# Altium schematic sheet [9] USB 2.0 .SchDoc: ARS Camera REV01 USB and WiFi
size A4; DrawnBy: Manh Ngo Van; Engineer: Manh Ngo Van; Organization: Altium Limited; Address1: L3, 12a Rodborough Rd; Address2: Frenchs Forest; Address3: NSW; Address4: Australia 2086; DocumentNumber: 9; Revision: 1.0; SheetNumber: 9; SheetTotal: 16
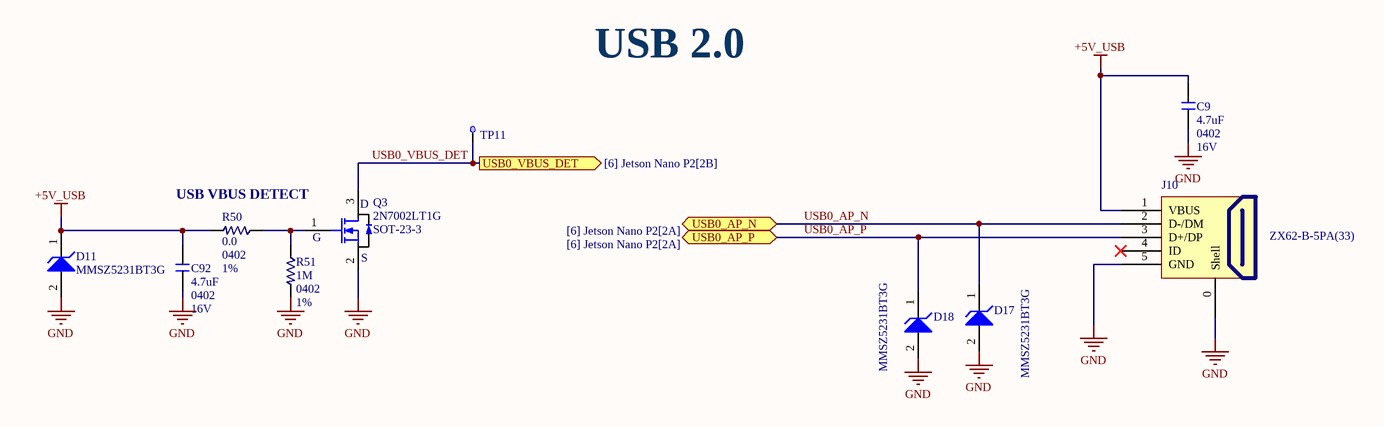
[diagram p0: [9] USB 2.0 .SchDoc]

## Parts
C9  4.7uF  Case/Package: 0402  Voltage Rating: 16V  [C0402M]
C92  4.7uF  Case/Package: 0402  Voltage Rating: 16V  [C0402M]
D11  MMSZ5231BT3G  [SODFL371X135-2N]
D17  MMSZ5231BT3G  [SODFL371X135-2N]
D18  MMSZ5231BT3G  [SODFL371X135-2N]
J10  ZX62-B-5PA(33)  [MICRO-USB-SMD_5P-P0.65-H-M_MICRO-USB-5P]
Q3  2N7002LT1G  Case/Package: SOT-23-3  [SOT95P245X110-3N]
R50  0.0  Case Code (Imperial): 0402  Tolerance: 1%  [R0402M]
R51  1M  Case Code (Imperial): 0402  Tolerance: 1%  [R0402M]
TP11  TP  [Test point]  (value not drawn)  (net tie, no BOM)

## Ports
USB0_AP_N (bidir, see [6] Jetson Nano P2[2A]), USB0_AP_P (bidir, see [6] Jetson Nano P2[2A]), USB0_VBUS_DET (out, see [6] Jetson Nano P2[2B])

## Nets
+5V_USB: C9.1 C92.1 D11.1(K) J10.1(VBUS) R50.1
GND: C9.2 C92.2 D11.2(A) D17.2(A) D18.2(A) J10.0(Shell) J10.5(GND) Q3.2(S) R51.1
USB0_AP_N: D17.1(K) J10.2(D-/DM) ; port USB0_AP_N
USB0_AP_P: D18.1(K) J10.3(D+/DP) ; port USB0_AP_P
USB0_VBUS_DET: Q3.3(D) TP11.1(TP) ; port USB0_VBUS_DET
NetQ3_1: Q3.1(G) R50.2 R51.2

Not connected (* = marked no-connect by the designer): J10 4(ID)*

## Notes on the sheet
- USB 2.0
- (near R50) USB VBUS DETECT
- Title
- Size:
- Date:
- A4
- Number:
- Time:
- Revision:
- Sheet
- of
- File:

## Library data of the parts
C9 C92 = CAP_CER: CAP CER 4.7UF 16V X5R 0402; Manufacturer: Samsung; Manufacturer Part Number: CL05A475MO5NUNC; Tolerance: 20%; ComponentLink1URL: https://datasheet.ciiva.com/25786/cl05a475mp5nrnc-25786963.pdf?src-supplier=Digi-Key; ComponentLink1Description: https://datasheet.ciiva.com/25786/cl05a475mp5nrnc-25786963.pdf?src-supplier=Digi-Key; ComponentLink2URL: https://datasheet.ciiva.com/16437/cl05b104kq5nnnc-16437353.pdf?src-supplier=Future+Electronics; ComponentLink2Description: https://datasheet.ciiva.com/16437/cl05b104kq5nnnc-16437353.pdf?src-supplier=Future+Electronics; Supplier 1: Digi-Key; Supplier Part Number 1: 1276-6836-6-ND; Stock 1: 1677309; Pricing 1: 1 = 0.45000, 10 = 0.32100, 100 = 0.21130, 500 = 0.15656, 1000 = 0.13307, 2500 = 0.12524, 5000 = 0.11741 (USD); RoHS: Yes; Mount: Surface Mount; Case Code (Imperial): 0402; Case Code (Metric): 1005; Min Operating Temperature: -55°C; Max Operating Temperature: 85°C; Packaging: Tape and Reel; Capacitance: 4.7uF; Length: 0.039inch; Width: 0.02inch; Thickness: 0.022inch; ComponentLink3URL: http://www.farnell.com/datasheets/2710653.pdf?src-supplier=Farnell; ComponentLink3Description: http://www.farnell.com/datasheets/2710653.pdf?src-supplier=Farnell; ComponentLink4URL: http://www.farnell.com/datasheets/2710653.pdf?src-supplier=Newark; ComponentLink4Description: http://www.farnell.com/datasheets/2710653.pdf?src-supplier=Newark; ComponentLink5URL: http://www.samsungsem.com/kr/support/product-search/mlcc/CL05A475MO5NUNC.jsp?src-supplier=Digi-Key; ComponentLink5Description: http://www.samsungsem.com/kr/support/product-search/mlcc/CL05A475MO5NUNC.jsp?src-supplier=Digi-Key
D11 D17 D18 = MMSZ5231BT3G: DIODE ZENER 5.1V 500MW SOD123; Manufacturer: ON Semiconductor; Impedance: 17R; Tolerance: 5%; ComponentLink1Description: Manufacturer URL; ComponentLink2Description: Datasheet; ComponentLink3Description: Package Specification; ComponentLink3URL: http://www.onsemi.com/pub_link/Collateral/425-04.PDF; ComponentLink1URL: http://www.onsemi.com/; ComponentLink2URL: http://www.onsemi.com/pub_link/Collateral/MMSZ5221BT1-D.PDF; ComponentLink4URL: https://media.digikey.com/pdf/Data%20Sheets/Ethertronics/M830120.pdf?src-supplier=Digi-Key; ComponentLink4Description: https://media.digikey.com/pdf/Data%20Sheets/Ethertronics/M830120.pdf?src-supplier=Digi-Key; ComponentLink5URL: http://datasheets.avx.com/ethertronics/AVX-E_M830120.pdf?src-supplier=Digi-Key; ComponentLink5Description: http://datasheets.avx.com/ethertronics/AVX-E_M830120.pdf?src-supplier=Digi-Key; Supplier 1: Digi-Key; Supplier Part Number 1: MMSZ5231BT3GOSCT-ND; Manufacturer Part Number: MMSZ5231BT3G; Stock 1: 3780; Pricing 1: 1 = 0.21000, 10 = 0.15000, 100 = 0.08090, 500 = 0.06350, 1000 = 0.04410, 2000 = 0.03653, 5000 = 0.03455 (USD); RoHS: Yes; Case/Package: SOD-123-2; Number of Pins: 2; Min Operating Temperature: -55°C; Max Operating Temperature: 150°C; Packaging: Tape and Reel; Zener Voltage: 5.1V; Max Power Dissipation: 500mW; Lead Free: Lead Free; ComponentLink6URL: http://www.mouser.com/ds/2/308/MMSZ5221BT1-D-85810.pdf?src-supplier=Mouser; ComponentLink6Description: http://www.mouser.com/ds/2/308/MMSZ5221BT1-D-85810.pdf?src-supplier=Mouser; ComponentLink7URL: https://4donline.ihs.com/images/VipMasterIC/IC/ONSM/ONSM-S-A0000726829/ONSM-S-A0000726829-1.pdf?hkey=52A5661711E402568146F3353EA87419&src-supplier=Farnell; ComponentLink7Description: https://4donline.ihs.com/images/VipMasterIC/IC/ONSM/ONSM-S-A0000726829/ONSM-S-A0000726829-1.pdf?hkey=52A5661711E402568146F3353EA87419&src-supplier=Farnell; ComponentLink8URL: http://www.onsemi.com/pub/Collateral/MMSZ5221BT1-D.PDF?src-supplier=Digi-Key; ComponentLink8Description: http://www.onsemi.com/pub/Collateral/MMSZ5221BT1-D.PDF?src-supplier=Digi-Key; ComponentLink9URL: https://4donline.ihs.com/images/VipMasterIC/IC/ONSM/ONSM-S-A0000726829/ONSM-S-A0000726829-1.pdf?hkey=52A5661711E402568146F3353EA87419&src-supplier=Newark; ComponentLink9Description: https://4donline.ihs.com/images/VipMasterIC/IC/ONSM/ONSM-S-A0000726829/ONSM-S-A0000726829-1.pdf?hkey=52A5661711E402568146F3353EA87419&src-supplier=Newark; ComponentLink10URL: http://www.onsemi.com/pub/Collateral/MMSZ5221BT1-D.PDF?src-supplier=Avnet; ComponentLink10Description: http://www.onsemi.com/pub/Collateral/MMSZ5221BT1-D.PDF?src-supplier=Avnet; ComponentLink11URL: http://www.onsemi.com/pub_link/Collateral/MMSZ5221BT1-D.PDF?src-supplier=Digi-Key; ComponentLink11Description: http://www.onsemi.com/pub_link/Collateral/MMSZ5221BT1-D.PDF?src-supplier=Digi-Key
J10 = USB Mini: USB - micro B USB 2.0 Receptacle Connector 5 Position Surface Mount, Right Angle; Manufacturer: Hirose; Number of Contacts: 5; USB Standard: USB 2.0; Current Rating: 1.8A; Mating Cycles: 10000; ComponentLink1URL: https://www.molex.com/pdm_docs/sd/1050170001_sd.pdf; ComponentLink1Description: https://www.molex.com/pdm_docs/sd/1050170001_sd.pdf; Supplier 1: Digi-Key; Supplier Part Number 1: H125270CT-ND; Manufacturer Part Number: ZX62-B-5PA(33); Stock 1: 8359; Pricing 1: 1 = 0.84000, 10 = 0.79200, 25 = 0.71280, 50 = 0.63360, 100 = 0.60720, 250 = 0.55440, 500 = 0.52800, 1000 = 0.43560 (USD); RoHS: Yes; Mount: Surface Mount,Horizontal; Contact Material: Copper Alloy; Contact Plating: Gold; Packaging: Tape and Reel; Connector Type: USB; Gender: Receptacle; Orientation: Right Angle; REACH SVHC: Unknown; Lead Free: Lead Free; ComponentLink2URL: http://www.farnell.com/datasheets/2691174.pdf?src-supplier=Farnell; ComponentLink2Description: http://www.farnell.com/datasheets/2691174.pdf?src-supplier=Farnell; ComponentLink3URL: http://www.farnell.com/datasheets/2691174.pdf?src-supplier=Element14; ComponentLink3Description: http://www.farnell.com/datasheets/2691174.pdf?src-supplier=Element14; ComponentLink4URL: https://www.hirose.com/product/en/download_file/key_name/ZX62-B-5PA%2833%29/category/Specification%20Sheet/doc_file_id/87473/?file_category_id=9&item_id=02420033833&is_series=&src-supplier=Digi-Key; ComponentLink4Description: https://www.hirose.com/product/en/download_file/key_name/ZX62-B-5PA%2833%29/category/Specification%20Sheet/doc_file_id/87473/?file_category_id=9&item_id=02420033833&is_series=&src-supplier=Digi-Key; ComponentLink5URL: http://www.farnell.com/datasheets/2060515.pdf?src-supplier=Element14; ComponentLink5Description: http://www.farnell.com/datasheets/2060515.pdf?src-supplier=Element14; ComponentLink6URL: http://www.farnell.com/datasheets/2691174.pdf?src-supplier=Newark; ComponentLink6Description: http://www.farnell.com/datasheets/2691174.pdf?src-supplier=Newark
Q3 = NMOS: MOSFET N-CH 60V 0.115A SOT-23; Manufacturer: ON Semiconductor; Gate to Source Voltage (Vgs): 20V; Continuous Drain Current (ID): 115mA; Turn-Off Delay Time: 40ns; Turn-On Delay Time: 20ns; Rds On Max: 7.5R; Input Capacitance: 50pF; Nominal Vgs: 2.5V; Number of Elements: 1; Max Power Dissipation: 225mW; Element Configuration: Single; Power Dissipation: 300mW; ComponentLink1URL: https://datasheet.ciiva.com/6371/dmn65d8l-6371124.pdf?src-supplier=Digi-Key; ComponentLink1Description: https://datasheet.ciiva.com/6371/dmn65d8l-6371124.pdf?src-supplier=Digi-Key; ComponentLink2URL: https://datasheet.ciiva.com/13058/dmn65d8l-219098-13058455.pdf?src-supplier=Mouser; ComponentLink2Description: https://datasheet.ciiva.com/13058/dmn65d8l-219098-13058455.pdf?src-supplier=Mouser; ComponentLink3URL: https://datasheet.ciiva.com/6371/dmn65d8l-6371126.pdf?src-supplier=Digi-Key; ComponentLink3Description: https://datasheet.ciiva.com/6371/dmn65d8l-6371126.pdf?src-supplier=Digi-Key; ComponentLink4URL: https://datasheet.ciiva.com/6371/dmn65d8l-6371128.pdf?src-supplier=Digi-Key; ComponentLink4Description: https://datasheet.ciiva.com/6371/dmn65d8l-6371128.pdf?src-supplier=Digi-Key; Supplier 1: Digi-Key; Supplier Part Number 1: 2N7002LT1GOSCT-ND; Manufacturer Part Number: 2N7002LT1G; Stock 1: 616639; Pricing 1: 1 = 0.18000, 10 = 0.16400, 25 = 0.15640, 100 = 0.06880, 250 = 0.06600, 500 = 0.05400, 1000 = 0.03750 (USD); RoHS: Yes; Number of Pins: 3; Contact Plating: Tin,Matte; Min Operating Temperature: -55°C; Max Operating Temperature: 150°C; Package Quantity: 1; On-State Resistance: 7.5R; Packaging: Tape and Reel; Drain to Source Voltage (Vdss): 60V; Drain to Source Breakdown Voltage: 60V; Drain to Source Resistance: 7.5R; Threshold Voltage: 2.5V; Voltage Rating (DC): 60V; Current Rating: 115mA; Number of Channels: 1; Length: 3.04mm; Height: 1.01mm; Width: 1.4mm; Radiation Hardening: No; Lead Free: Lead Free; Halogen Free: Halogen Free; REACH SVHC: No SVHC; ComponentLink5URL: https://datasheet.ciiva.com/936/2n7002l-d-936784.pdf?src-supplier=Digi-Key; ComponentLink5Description: https://datasheet.ciiva.com/936/2n7002l-d-936784.pdf?src-supplier=Digi-Key; ComponentLink6URL: https://datasheet.ciiva.com/22749/1747988-22749570.pdf?src-supplier=Element14; ComponentLink6Description: https://datasheet.ciiva.com/22749/1747988-22749570.pdf?src-supplier=Element14; ComponentLink7URL: https://datasheet.ciiva.com/1188/97418-1188470.pdf?src-supplier=Element14; ComponentLink7Description: https://datasheet.ciiva.com/1188/97418-1188470.pdf?src-supplier=Element14; ComponentLink8URL: https://datasheet.ciiva.com/936/2n7002l-d-936785.pdf?src-supplier=Digi-Key; ComponentLink8Description: https://datasheet.ciiva.com/936/2n7002l-d-936785.pdf?src-supplier=Digi-Key; ComponentLink9URL: https://datasheet.ciiva.com/936/2n7002l-d-936786.pdf?src-supplier=Digi-Key; ComponentLink9Description: https://datasheet.ciiva.com/936/2n7002l-d-936786.pdf?src-supplier=Digi-Key; ComponentLink10URL: https://datasheet.ciiva.com/1254/1747988-1254500.pdf?src-supplier=Newark; ComponentLink10Description: https://datasheet.ciiva.com/1254/1747988-1254500.pdf?src-supplier=Newark; ComponentLink11URL: https://datasheet.ciiva.com/24157/2n7002l-d-24157398.pdf?src-supplier=Future+Electronics; ComponentLink11Description: https://datasheet.ciiva.com/24157/2n7002l-d-24157398.pdf?src-supplier=Future+Electronics; ComponentLink12URL: https://datasheet.ciiva.com/1188/97418-1188471.pdf?src-supplier=Element14; ComponentLink12Description: https://datasheet.ciiva.com/1188/97418-1188471.pdf?src-supplier=Element14; ComponentLink13URL: https://datasheet.ciiva.com/8114/2n7002l-d-8114823.pdf?src-supplier=Avnet; ComponentLink13Description: https://datasheet.ciiva.com/8114/2n7002l-d-8114823.pdf?src-supplier=Avnet; ComponentLink14URL: https://datasheet.ciiva.com/3304/2n7002l-d-3304393.pdf?src-supplier=Avnet; ComponentLink14Description: https://datasheet.ciiva.com/3304/2n7002l-d-3304393.pdf?src-supplier=Avnet; ComponentLink15URL: https://datasheet.ciiva.com/26146/2n7002l-d-26146173.pdf?src-supplier=Avnet+Europe; ComponentLink15Description: https://datasheet.ciiva.com/26146/2n7002l-d-26146173.pdf?src-supplier=Avnet+Europe; ComponentLink16URL: https://datasheet.ciiva.com/16542/2n7002l-d-16542607.pdf?src-supplier=Avnet+Asia; ComponentLink16Description: https://datasheet.ciiva.com/16542/2n7002l-d-16542607.pdf?src-supplier=Avnet+Asia
R50 = RES_SMD: RES SMD 0 OHM JUMPER 1/16W 0402; Manufacturer: Yageo; Manufacturer Part Number: RC0402FR-070RL; Resistance: 0mR; Power Rating: 62.5mW; Voltage Rating: 50V; Temperature Coefficient: 200ppm/°C; Supplier 1: Digi-Key; Supplier Part Number 1: 311-0.0LRCT-ND; Stock 1: 3964331; Pricing 1: 1 = 0.10000, 10 = 0.01200, 25 = 0.00840, 50 = 0.00640, 100 = 0.00470, 250 = 0.00360, 500 = 0.00288, 1000 = 0.00212, 5000 = 0.00152 (USD); RoHS: Yes; Mount: Surface Mount; Case/Package: 0402; Contact Plating: Tin,Matte; Case Code (Metric): 1005; Min Operating Temperature: -55°C; Max Operating Temperature: 155°C; Resistor Type: Thick Film; Packaging: Tape and Reel; Termination: SMD/SMT; Length: 1mm; Width: 0.5mm; Height: 0.35mm; Radiation Hardening: No; Lead Free: Lead Free; ComponentLink1URL: https://datasheet.ciiva.com/8896/pyu-rc0402-51-rohs-l-6-8896149.pdf?src-supplier=Avnet; ComponentLink1Description: https://datasheet.ciiva.com/8896/pyu-rc0402-51-rohs-l-6-8896149.pdf?src-supplier=Avnet; ComponentLink2URL: https://datasheet.ciiva.com/16790/pyu-rc0402-51-rohs-l-6-r-16790444.pdf?src-supplier=Future+Electronics; ComponentLink2Description: https://datasheet.ciiva.com/16790/pyu-rc0402-51-rohs-l-6-r-16790444.pdf?src-supplier=Future+Electronics; ComponentLink3URL: https://datasheet.ciiva.com/28419/pyu-rc0402-51-rohs-l-6-28419661.pdf?src-supplier=Avnet+Europe; ComponentLink3Description: https://datasheet.ciiva.com/28419/pyu-rc0402-51-rohs-l-6-28419661.pdf?src-supplier=Avnet+Europe; ComponentLink4URL: https://datasheet.ciiva.com/16869/pyu-rc0402-51-rohs-l-6-16869518.pdf?src-supplier=Avnet+Europe; ComponentLink4Description: https://datasheet.ciiva.com/16869/pyu-rc0402-51-rohs-l-6-16869518.pdf?src-supplier=Avnet+Europe
R51 = RES_SMD: RES SMD 1M OHM 1% 1/16W 0402; Manufacturer: Yageo; Manufacturer Part Number: RC0402FR-071ML; Resistance: 1MR; Power Rating: 63mW; Voltage Rating: 50V; Temperature Coefficient: 100ppm/°C; Supplier 1: Digi-Key; Supplier Part Number 1: 311-1.00MLRCT-ND; Stock 1: 5211374; Pricing 1: 1 = 0.10000, 10 = 0.01400, 100 = 0.00580, 1000 = 0.00260, 2500 = 0.00226, 5000 = 0.00186 (USD); RoHS: Yes; Case/Package: 0402; Case Code (Metric): 1005; Min Operating Temperature: -55°C; Max Operating Temperature: 155°C; Resistor Type: Thick Film; Packaging: Tape and Reel; Termination: SMD/SMT; Length: 1mm; Height: 0.32mm; Depth: 0.5mm; REACH SVHC: Unknown; Military Standard: Not; Lead Free: Lead Free; ComponentLink1URL: https://datasheet.ciiva.com/11808/0900766b80c66297-11808125.pdf?src-supplier=RSComponents; ComponentLink1Description: https://datasheet.ciiva.com/11808/0900766b80c66297-11808125.pdf?src-supplier=RSComponents; ComponentLink2URL: https://datasheet.ciiva.com/46394/1018594-46394951.pdf?src-supplier=Element14; ComponentLink2Description: https://datasheet.ciiva.com/46394/1018594-46394951.pdf?src-supplier=Element14; ComponentLink3URL: https://datasheet.ciiva.com/16741/pyu-rc0402-51-rohs-l-6-r-16741081.pdf?src-supplier=Future+Electronics; ComponentLink3Description: https://datasheet.ciiva.com/16741/pyu-rc0402-51-rohs-l-6-r-16741081.pdf?src-supplier=Future+Electronics; ComponentLink4URL: https://datasheet.ciiva.com/7849/1018594-7849882.pdf?src-supplier=Element14; ComponentLink4Description: https://datasheet.ciiva.com/7849/1018594-7849882.pdf?src-supplier=Element14; ComponentLink5URL: https://datasheet.ciiva.com/7849/1018594-7849883.pdf?src-supplier=Element14; ComponentLink5Description: https://datasheet.ciiva.com/7849/1018594-7849883.pdf?src-supplier=Element14
TP11 = TestPoint